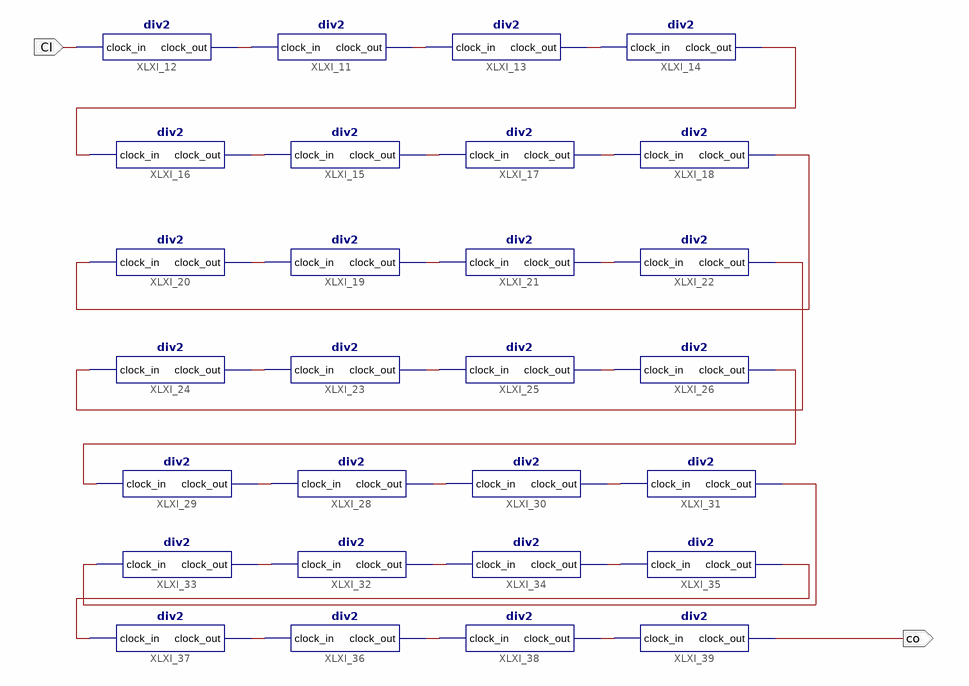
[diagram p0: schematic sheet 1]
// Xilinx ISE schematic DIV.sch (spartan6) as structural Verilog: 28 symbols, 2 ports
module DIV (
  input  CI,
  output co
);

  wire XLXN_22, XLXN_23, XLXN_24, XLXN_26, XLXN_27, XLXN_28, XLXN_29, XLXN_30, XLXN_31, XLXN_32, XLXN_33,
       XLXN_34, XLXN_35, XLXN_36, XLXN_37, XLXN_58, XLXN_59, XLXN_60, XLXN_61, XLXN_62, XLXN_63, XLXN_64,
       XLXN_65, XLXN_66, XLXN_67, XLXN_68, XLXN_69;

  div2 XLXI_11 (.clock_in(XLXN_22), .clock_out(XLXN_23));
  div2 XLXI_12 (.clock_in(CI), .clock_out(XLXN_22));
  div2 XLXI_13 (.clock_in(XLXN_23), .clock_out(XLXN_24));
  div2 XLXI_14 (.clock_in(XLXN_24), .clock_out(XLXN_29));
  div2 XLXI_15 (.clock_in(XLXN_26), .clock_out(XLXN_27));
  div2 XLXI_16 (.clock_in(XLXN_29), .clock_out(XLXN_26));
  div2 XLXI_17 (.clock_in(XLXN_27), .clock_out(XLXN_28));
  div2 XLXI_18 (.clock_in(XLXN_28), .clock_out(XLXN_33));
  div2 XLXI_19 (.clock_in(XLXN_30), .clock_out(XLXN_31));
  div2 XLXI_20 (.clock_in(XLXN_33), .clock_out(XLXN_30));
  div2 XLXI_21 (.clock_in(XLXN_31), .clock_out(XLXN_32));
  div2 XLXI_22 (.clock_in(XLXN_32), .clock_out(XLXN_37));
  div2 XLXI_23 (.clock_in(XLXN_34), .clock_out(XLXN_35));
  div2 XLXI_24 (.clock_in(XLXN_37), .clock_out(XLXN_34));
  div2 XLXI_25 (.clock_in(XLXN_35), .clock_out(XLXN_36));
  div2 XLXI_26 (.clock_in(XLXN_36), .clock_out(XLXN_61));
  div2 XLXI_28 (.clock_in(XLXN_58), .clock_out(XLXN_59));
  div2 XLXI_29 (.clock_in(XLXN_61), .clock_out(XLXN_58));
  div2 XLXI_30 (.clock_in(XLXN_59), .clock_out(XLXN_60));
  div2 XLXI_31 (.clock_in(XLXN_60), .clock_out(XLXN_65));
  div2 XLXI_32 (.clock_in(XLXN_62), .clock_out(XLXN_63));
  div2 XLXI_33 (.clock_in(XLXN_65), .clock_out(XLXN_62));
  div2 XLXI_34 (.clock_in(XLXN_63), .clock_out(XLXN_64));
  div2 XLXI_35 (.clock_in(XLXN_64), .clock_out(XLXN_69));
  div2 XLXI_36 (.clock_in(XLXN_66), .clock_out(XLXN_67));
  div2 XLXI_37 (.clock_in(XLXN_69), .clock_out(XLXN_66));
  div2 XLXI_38 (.clock_in(XLXN_67), .clock_out(XLXN_68));
  div2 XLXI_39 (.clock_in(XLXN_68), .clock_out(co));
endmodule
